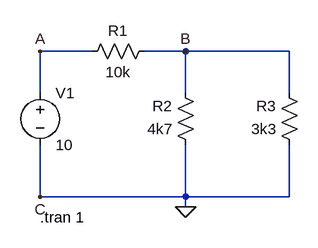
[diagram p0: schematic TP1_1.asc]
TP1_1.asc, the LTspice schematic file:
Version 4.1
SHEET 1 880 680
WIRE 64 -192 -16 -192
WIRE 208 -192 144 -192
WIRE 368 -192 208 -192
WIRE -16 -128 -16 -192
WIRE 208 -128 208 -192
WIRE 368 -128 368 -192
WIRE -16 32 -16 -48
WIRE 208 32 208 -48
WIRE 208 32 -16 32
WIRE 368 32 368 -48
WIRE 368 32 208 32
WIRE 208 48 208 32
FLAG 208 48 0
FLAG -16 -192 A
FLAG 208 -192 B
FLAG -16 32 C
SYMBOL res 160 -208 R90
WINDOW 0 0 56 VBottom 2
WINDOW 3 32 56 VTop 2
SYMATTR InstName R1
SYMATTR Value 10k
SYMBOL res 224 -32 R180
WINDOW 0 36 76 Left 2
WINDOW 3 36 40 Left 2
SYMATTR InstName R2
SYMATTR Value 4k7
SYMBOL res 384 -32 R180
WINDOW 0 36 76 Left 2
WINDOW 3 36 40 Left 2
SYMATTR InstName R3
SYMATTR Value 3k3
SYMBOL voltage -16 -144 R0
WINDOW 123 0 0 Left 0
WINDOW 39 0 0 Left 0
SYMATTR InstName V1
SYMATTR Value 10
TEXT -16 64 Left 2 !.tran 1

The netlist it stands for:
* TP1_1.asc
R1 B A 10k
R2 0 B 4k7
R3 0 B 3k3
V1 A 0 10
.tran 1
.backanno
.end